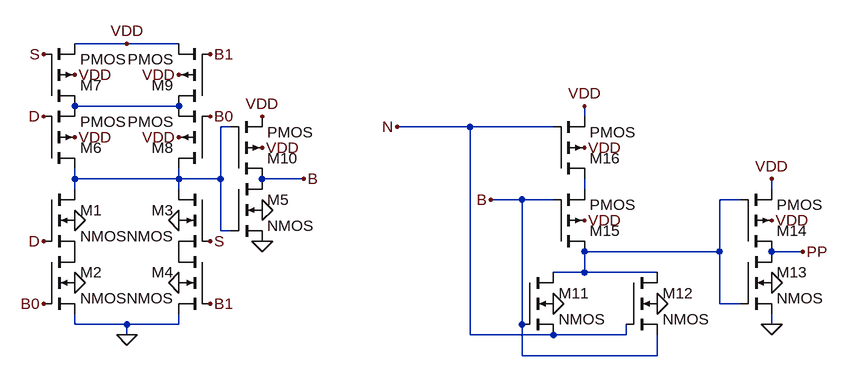
[diagram p0: schematic Selector-v1.asc]
Selector-v1.asc, the LTspice schematic file:
Version 4
SHEET 1 1492 680
WIRE 336 -144 256 -144
WIRE 416 -144 336 -144
WIRE 416 -48 256 -48
WIRE 1040 -32 1040 -48
WIRE 496 -16 480 -16
WIRE 864 -16 752 -16
WIRE 992 -16 864 -16
WIRE 256 64 256 48
WIRE 416 64 416 48
WIRE 416 64 256 64
WIRE 480 64 480 -16
WIRE 480 64 416 64
WIRE 608 64 544 64
WIRE 256 80 256 64
WIRE 416 80 416 64
WIRE 1040 80 1040 64
WIRE 1328 80 1328 64
WIRE 944 96 896 96
WIRE 992 96 944 96
WIRE 1280 96 1248 96
WIRE 480 144 480 64
WIRE 496 144 480 144
WIRE 1248 176 1248 96
WIRE 1248 176 1040 176
WIRE 1376 176 1328 176
WIRE 1040 208 1040 176
WIRE 1040 208 992 208
WIRE 1152 208 1040 208
WIRE 1248 256 1248 176
WIRE 1280 256 1248 256
WIRE 256 288 256 272
WIRE 336 288 256 288
WIRE 416 288 416 272
WIRE 416 288 336 288
WIRE 944 288 944 96
WIRE 1328 288 1328 272
WIRE 336 304 336 288
WIRE 864 304 864 -16
WIRE 992 304 864 304
WIRE 1104 304 1104 288
WIRE 1104 304 992 304
WIRE 944 336 944 288
WIRE 1152 336 1152 304
WIRE 1152 336 944 336
FLAG 544 160 0
FLAG 544 112 0
FLAG 416 128 0
FLAG 256 128 0
FLAG 256 224 0
FLAG 416 224 0
FLAG 336 304 0
FLAG 336 -144 VDD
FLAG 544 -32 VDD
FLAG 544 16 VDD
FLAG 208 -128 S
FLAG 464 160 S
FLAG 208 160 D
FLAG 208 -32 D
FLAG 208 256 B0
FLAG 464 -32 B0
FLAG 464 -128 B1
FLAG 464 256 B1
FLAG 416 0 VDD
FLAG 416 -96 VDD
FLAG 256 -96 VDD
FLAG 256 0 VDD
FLAG 608 64 B
FLAG 992 256 0
FLAG 1152 256 0
FLAG 1040 128 VDD
FLAG 1040 16 VDD
FLAG 1040 -48 VDD
FLAG 1328 224 0
FLAG 1328 288 0
FLAG 1328 128 VDD
FLAG 1328 64 VDD
FLAG 896 96 B
FLAG 752 -16 N
FLAG 1376 176 PP
SYMBOL nmos4 208 80 R0
SYMATTR InstName M1
SYMBOL nmos4 208 176 R0
SYMATTR InstName M2
SYMBOL nmos4 464 80 M0
SYMATTR InstName M3
SYMBOL nmos4 464 176 M0
SYMATTR InstName M4
SYMBOL nmos4 496 64 R0
SYMATTR InstName M5
SYMBOL pmos4 208 48 M180
SYMATTR InstName M6
SYMBOL pmos4 208 -48 M180
SYMATTR InstName M7
SYMBOL pmos4 464 48 R180
SYMATTR InstName M8
SYMBOL pmos4 464 -48 R180
SYMATTR InstName M9
SYMBOL pmos4 496 64 M180
SYMATTR InstName M10
SYMBOL nmos4 944 208 R0
SYMATTR InstName M11
SYMBOL nmos4 1104 208 R0
SYMATTR InstName M12
SYMBOL nmos4 1280 176 R0
SYMATTR InstName M13
SYMBOL pmos4 1280 176 M180
SYMATTR InstName M14
SYMBOL pmos4 992 176 M180
SYMATTR InstName M15
SYMBOL pmos4 992 64 M180
SYMATTR InstName M16

The netlist it stands for:
* Selector-v1.asc
M1 N002 D P001 0 NMOS
M2 P001 B0 0 0 NMOS
M3 N002 S P002 0 NMOS
M4 P002 B1 0 0 NMOS
M5 B N002 0 0 NMOS
M6 N002 D N001 VDD PMOS
M7 N001 S VDD VDD PMOS
M8 N002 B0 N001 VDD PMOS
M9 N001 B1 VDD VDD PMOS
M10 B N002 VDD VDD PMOS
M11 N004 B N 0 NMOS
M12 N004 N B 0 NMOS
M13 PP N004 0 0 NMOS
M14 PP N004 VDD VDD PMOS
M15 N004 B N003 VDD PMOS
M16 N003 N VDD VDD PMOS
.model NMOS NMOS
.model PMOS PMOS
.lib standard.mos
.backanno
.end